# EasyEDA Pro project 自动化214呙凯锋.eprj

# Schematic 单相调压电路
Board Name: Board1; Create Date: 2024-12-08; Page Name: P1; Project Name: 自动化214呙凯锋; Schematic Name: 单相调压电路; Update Date: 2024-12-09; Company: 仲恺农业工程学院; Drawed: 呙凯锋; Page Size: A4; Version: V1.0
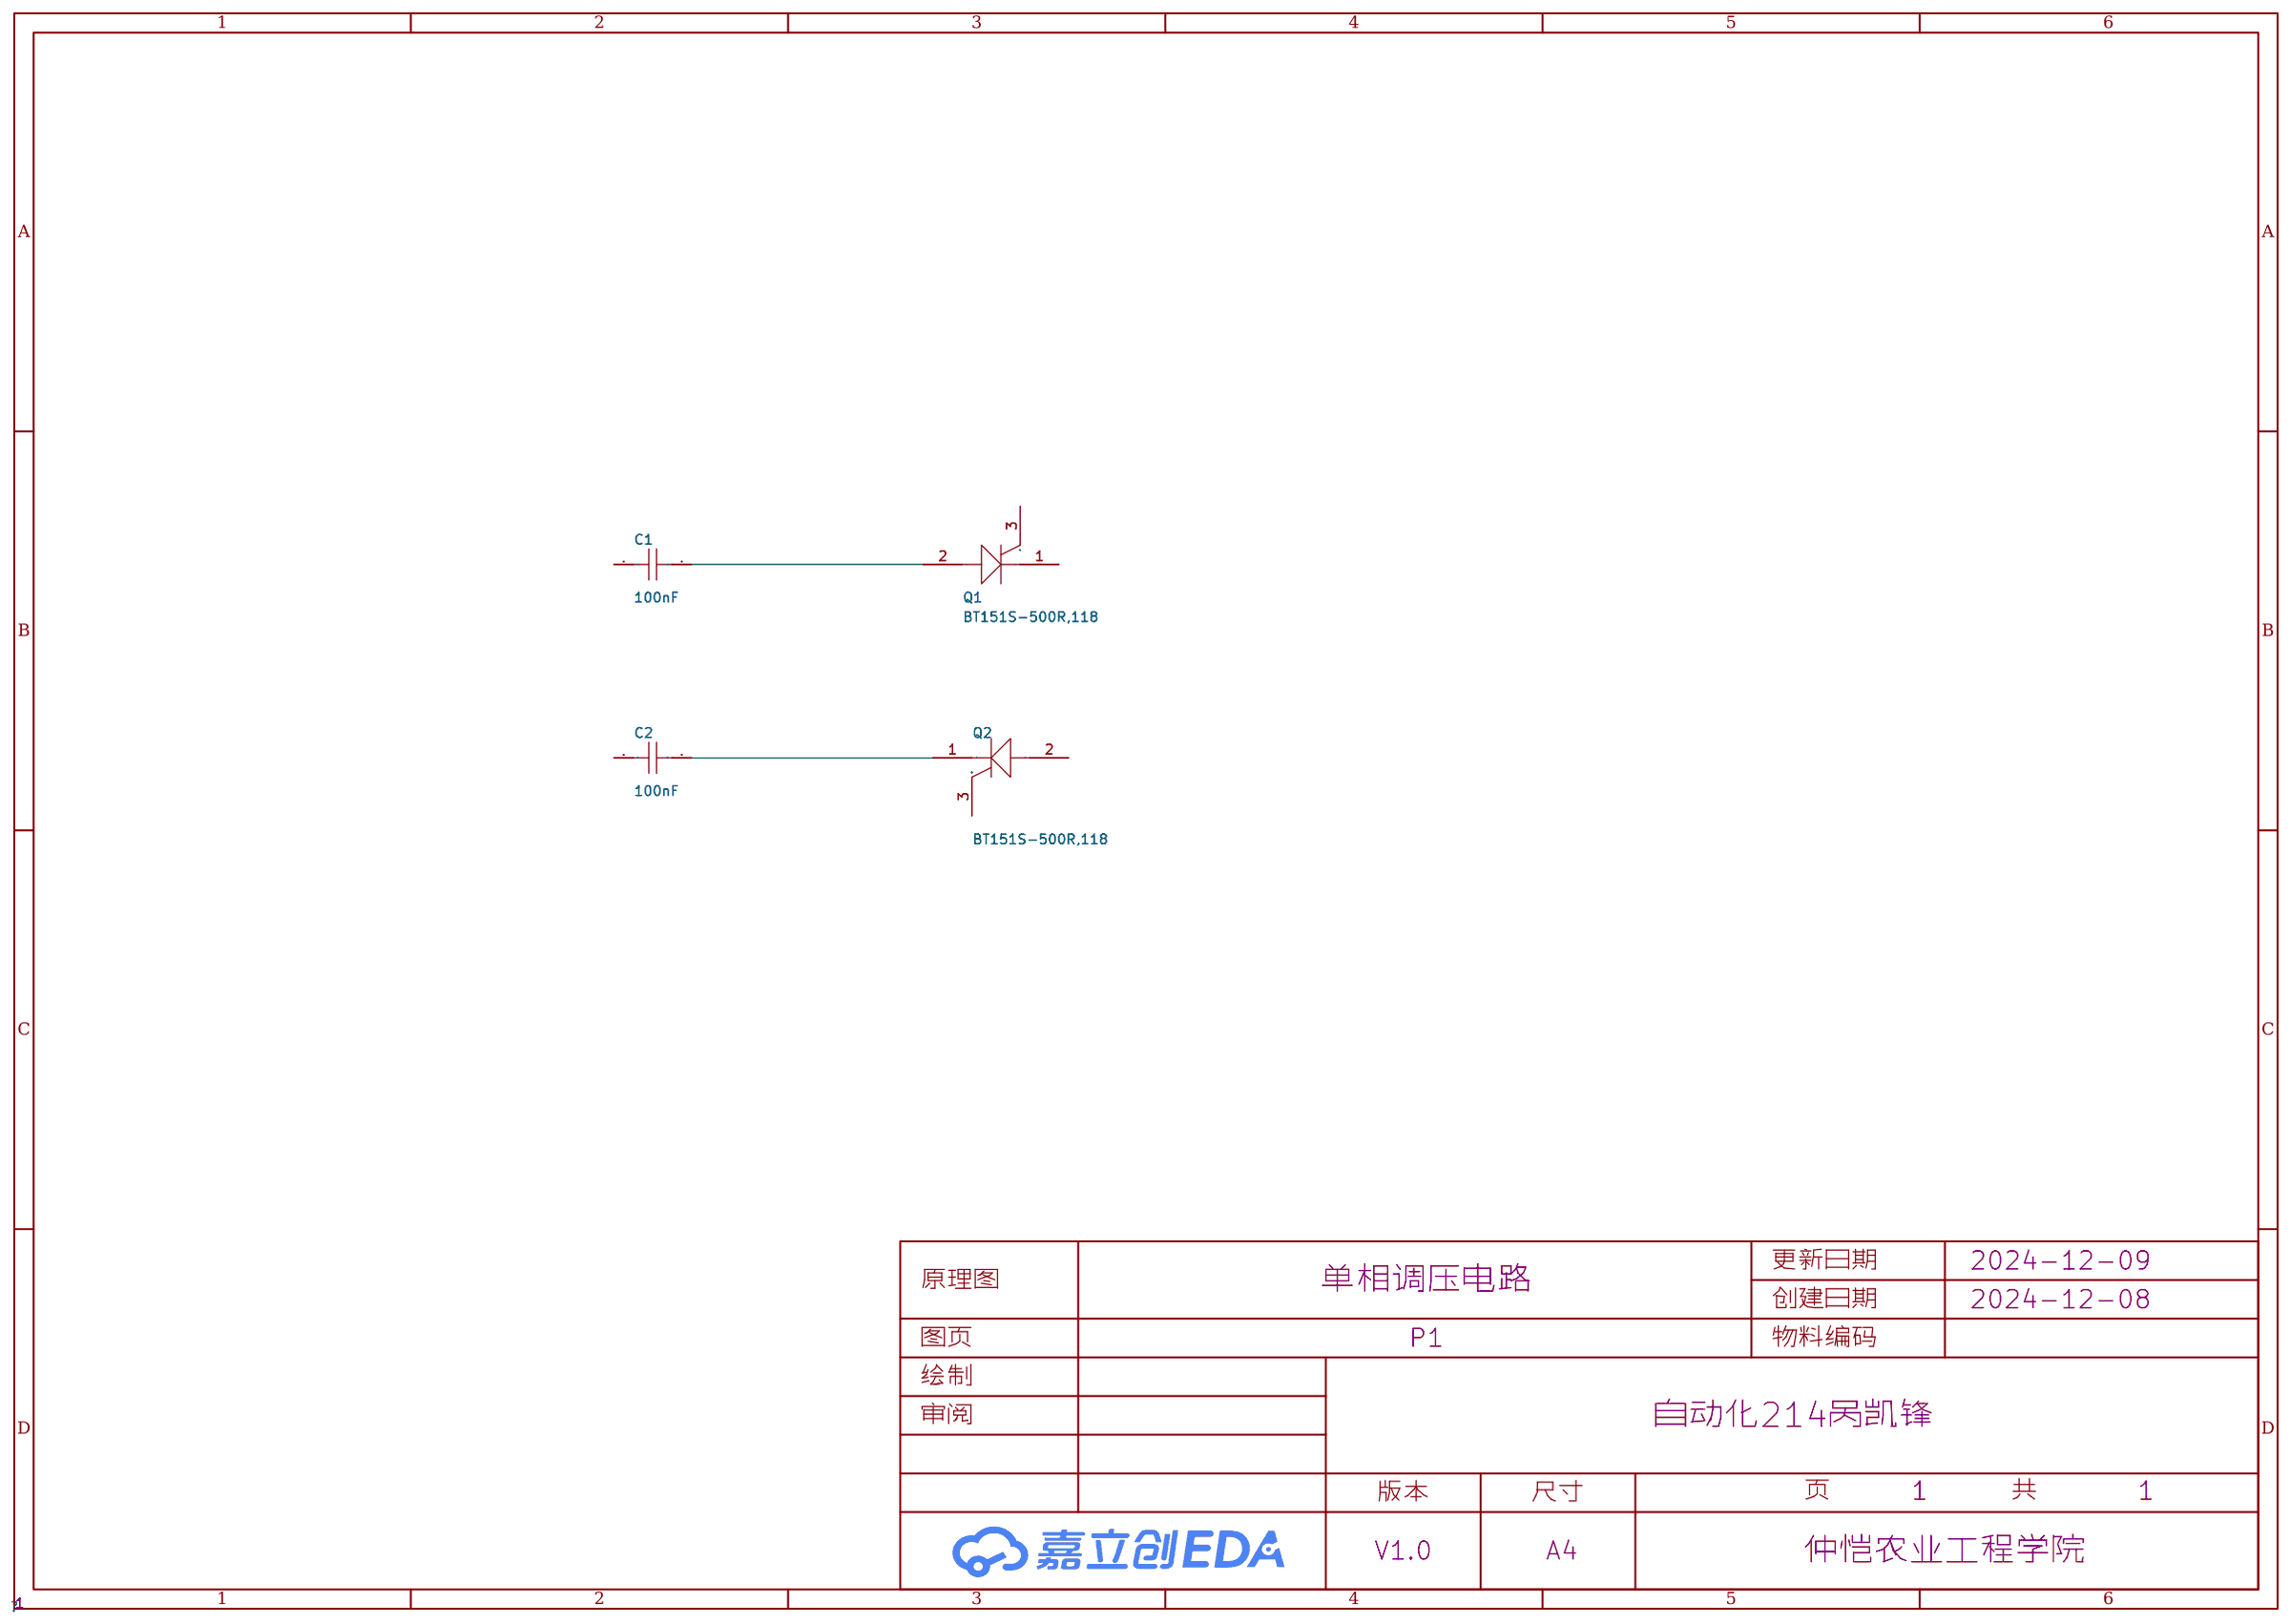
[diagram p0: schematic sheet]

## Parts
C1  100nF  [C0603]
C2  100nF  [C0603]
Q1  BT151S-500R,118  [DPAK-3_L6.6-W6.1-P2.28-LS9.9-BR]
Q2  BT151S-500R,118  [DPAK-3_L6.6-W6.1-P2.28-LS9.9-BR]

## Library data of the parts
C1 C2 = CAP_0603: Supplier Footprint: 0603
Q1 Q2 = BT151S-500R,118: Supplier Part: C909686; Manufacturer: WeEn(瑞能); Supplier Footprint: DPAK; JLCPCB Part Class: 扩展库; Datasheet: https://atta.szlcsc.com/upload/public/pdf/source/20201023/C909686_0B35B9AF067EED6C5B9ABE2201E4480A.pdf; Supplier: LCSC; SCR Type: 1个单向可控硅; Gate Trigger   Voltage (Vgt): 1.5V; Holding Current (Ih): 20mA; Peak Repetitive Off?State Voltage (Vdrm): 500V; Gate Trigger Current(Igt): 15mA; Peak Forward On?State Voltage (Vtm): 1.75V; RMS On-State Current(It (rms)): 12A; Operating Temperature: -40℃~+125℃

## Nets
Net-(C1-2): C1.2 Q1.2(A)
Net-(C2-2): C2.2 Q2.1(K)

Not connected (* = marked no-connect by the designer): C1 1; C2 1; Q1 1(K) 3(G); Q2 2(A) 3(G)
